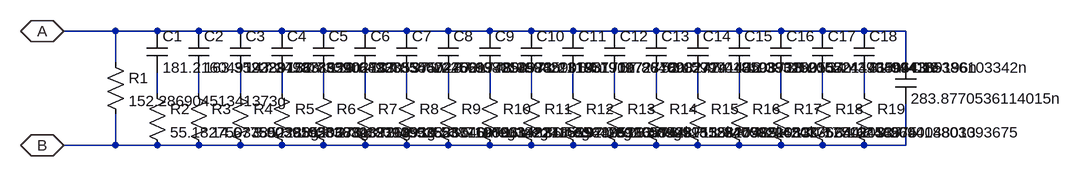
[diagram p0: schematic cpe2.asc]
cpe2.asc, the LTspice schematic file:
Version 4
Sheet 1 1212 680
FLAG 0 0 A
IOPIN 0 0 BiDir
FLAG 0 176 B
IOPIN 0 176 BiDir
WIRE 80 48 80 0
SYMBOL res 64 32 R0
SYMATTR InstName R1
SYMATTR Value 152.28690451341373g
WIRE 80 128 80 176
SYMBOL cap 128 0 R0
SYMATTR InstName C1
SYMATTR Value 181.21604919389156n
WIRE 144 96 144 64
SYMBOL res 128 80 R0
SYMATTR InstName R2
SYMATTR Value 55.18275033852288g
SYMBOL cap 192 0 R0
SYMATTR InstName C2
SYMATTR Value 163.35222877831924n
WIRE 208 96 208 64
SYMBOL res 192 80 R0
SYMATTR InstName R3
SYMATTR Value 14.677500365520673g
SYMBOL cap 256 0 R0
SYMATTR InstName C3
SYMATTR Value 147.24937865902783n
WIRE 272 96 272 64
SYMBOL res 256 80 R0
SYMATTR InstName R4
SYMATTR Value 3.9039195338813926g
SYMBOL cap 320 0 R0
SYMATTR InstName C4
SYMATTR Value 132.73390683205375n
WIRE 336 96 336 64
SYMBOL res 320 80 R0
SYMATTR InstName R5
SYMATTR Value 1.03836398211393g
SYMBOL cap 384 0 R0
SYMATTR InstName C5
SYMATTR Value 119.64933355472706n
WIRE 400 96 400 64
SYMBOL res 384 80 R0
SYMATTR InstName R6
SYMATTR Value 276.18390952836046meg
SYMBOL cap 448 0 R0
SYMATTR InstName C6
SYMATTR Value 107.85460446217489n
WIRE 464 96 464 64
SYMBOL res 448 80 R0
SYMATTR InstName R7
SYMATTR Value 73.45935837169706meg
SYMBOL cap 512 0 R0
SYMATTR InstName C7
SYMATTR Value 97.22256997253973n
WIRE 528 96 528 64
SYMBOL res 512 80 R0
SYMATTR InstName R8
SYMATTR Value 19.53871006314831meg
SYMBOL cap 576 0 R0
SYMATTR InstName C8
SYMATTR Value 87.63861458859019n
WIRE 592 96 592 64
SYMBOL res 576 80 R0
SYMATTR InstName R9
SYMATTR Value 5.196903422435292meg
SYMBOL cap 640 0 R0
SYMATTR InstName C9
SYMATTR Value 78.9994213193171n
WIRE 656 96 656 64
SYMBOL res 640 80 R0
SYMATTR InstName R10
SYMATTR Value 1.3822716594305113meg
SYMBOL cap 704 0 R0
SYMATTR InstName C10
SYMATTR Value 71.21185790172778n
WIRE 720 96 720 64
SYMBOL res 704 80 R0
SYMATTR InstName R11
SYMATTR Value 367.6564263665744k
SYMBOL cap 768 0 R0
SYMATTR InstName C11
SYMATTR Value 64.19197281608272n
WIRE 784 96 784 64
SYMBOL res 768 80 R0
SYMATTR InstName R12
SYMATTR Value 97.78920585287135k
SYMBOL cap 832 0 R0
SYMATTR InstName C12
SYMATTR Value 57.8640902714143n
WIRE 848 96 848 64
SYMBOL res 832 80 R0
SYMATTR InstName R13
SYMATTR Value 26.009959558820995k
SYMBOL cap 896 0 R0
SYMATTR InstName C13
SYMATTR Value 52.15999440508718n
WIRE 912 96 912 64
SYMBOL res 896 80 R0
SYMATTR InstName R14
SYMATTR Value 6.918125475621083k
SYMBOL cap 960 0 R0
SYMATTR InstName C14
SYMATTR Value 47.01819390190557n
WIRE 976 96 976 64
SYMBOL res 960 80 R0
SYMATTR InstName R15
SYMATTR Value 1.8400820650336644k
SYMBOL cap 1024 0 R0
SYMATTR InstName C15
SYMATTR Value 42.383259105211465n
WIRE 1040 96 1040 64
SYMBOL res 1024 80 R0
SYMATTR InstName R16
SYMATTR Value 489.42477525020337
SYMBOL cap 1088 0 R0
SYMATTR InstName C16
SYMATTR Value 38.20522447389643n
WIRE 1104 96 1104 64
SYMBOL res 1088 80 R0
SYMATTR InstName R17
SYMATTR Value 130.17713458575
SYMBOL cap 1152 0 R0
SYMATTR InstName C17
SYMATTR Value 34.43904994369196n
WIRE 1168 96 1168 64
SYMBOL res 1152 80 R0
SYMATTR InstName R18
SYMATTR Value 34.62449640048013
SYMBOL cap 1216 0 R0
SYMATTR InstName C18
SYMATTR Value 31.044135386103342n
WIRE 1232 96 1232 64
SYMBOL res 1216 80 R0
SYMATTR InstName R19
SYMATTR Value 9.209418803093675
WIRE 1296 48 1296 0
SYMBOL cap 1280 48 R0
SYMATTR InstName C19
SYMATTR Value 283.8770536114015n
WIRE 1296 112 1296 176
WIRE 0 0 1296 0
WIRE 0 176 1296 176

The netlist it stands for:
* cpe2.asc
R1 A B 152.28690451341373g
C1 A N001 181.21604919389156n
R2 N001 B 55.18275033852288g
C2 A N002 163.35222877831924n
R3 N002 B 14.677500365520673g
C3 A N003 147.24937865902783n
R4 N003 B 3.9039195338813926g
C4 A N004 132.73390683205375n
R5 N004 B 1.03836398211393g
C5 A N005 119.64933355472706n
R6 N005 B 276.18390952836046meg
C6 A N006 107.85460446217489n
R7 N006 B 73.45935837169706meg
C7 A N007 97.22256997253973n
R8 N007 B 19.53871006314831meg
C8 A N008 87.63861458859019n
R9 N008 B 5.196903422435292meg
C9 A N009 78.9994213193171n
R10 N009 B 1.3822716594305113meg
C10 A N010 71.21185790172778n
R11 N010 B 367.6564263665744k
C11 A N011 64.19197281608272n
R12 N011 B 97.78920585287135k
C12 A N012 57.8640902714143n
R13 N012 B 26.009959558820995k
C13 A N013 52.15999440508718n
R14 N013 B 6.918125475621083k
C14 A N014 47.01819390190557n
R15 N014 B 1.8400820650336644k
C15 A N015 42.383259105211465n
R16 N015 B 489.42477525020337
C16 A N016 38.20522447389643n
R17 N016 B 130.17713458575
C17 A N017 34.43904994369196n
R18 N017 B 34.62449640048013
C18 A N018 31.044135386103342n
R19 N018 B 9.209418803093675
C19 A B 283.8770536114015n
.backanno
.end